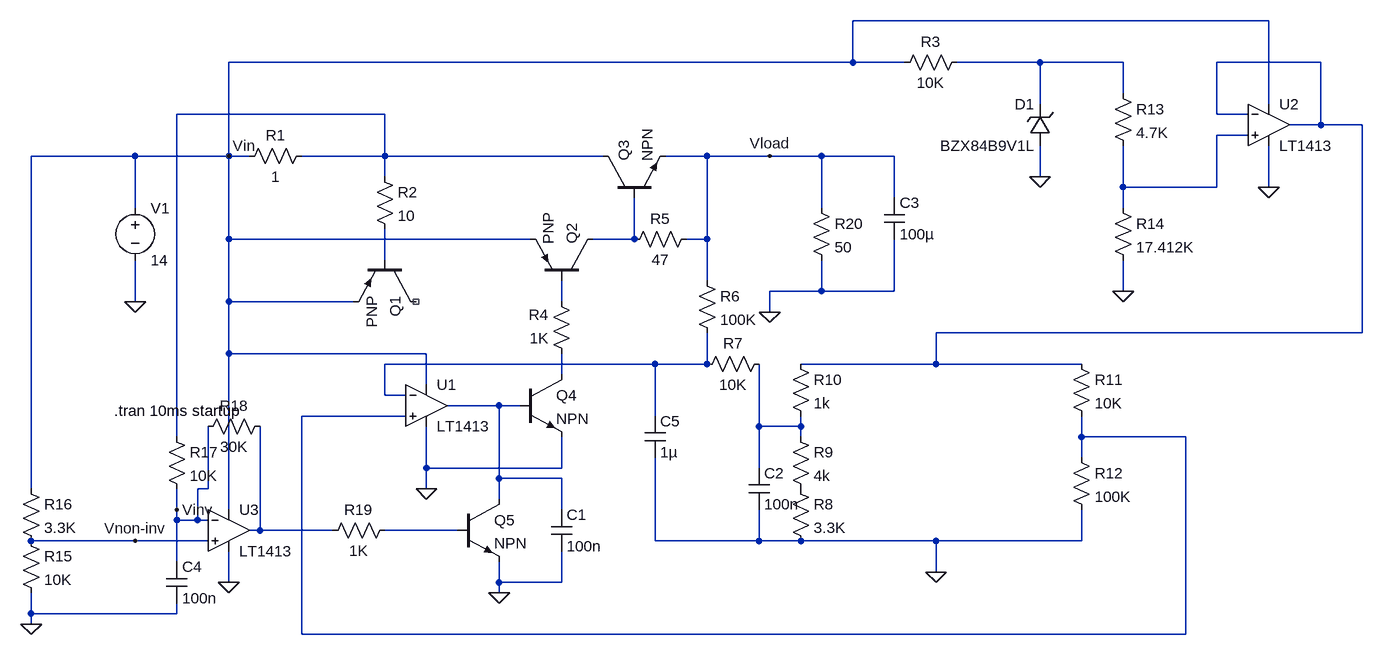
[diagram p0: schematic lm723_voltage_regulator.asc]
lm723_voltage_regulator.asc, the LTspice schematic file:
Version 4
SHEET 1 1988 804
WIRE 1840 -144 1200 -144
WIRE 1200 -80 1200 -144
WIRE 1200 -80 240 -80
WIRE 1280 -80 1200 -80
WIRE 1488 -80 1360 -80
WIRE 1616 -80 1488 -80
WIRE 1920 -80 1760 -80
WIRE 1616 -32 1616 -80
WIRE 1488 -16 1488 -80
WIRE 1840 -16 1840 -144
WIRE 480 0 160 0
WIRE 1760 0 1760 -80
WIRE 1808 0 1760 0
WIRE 1920 16 1920 -80
WIRE 1920 16 1872 16
WIRE 1984 16 1920 16
WIRE 1808 32 1760 32
WIRE 96 64 -64 64
WIRE 240 64 240 -80
WIRE 240 64 96 64
WIRE 272 64 240 64
WIRE 480 64 480 0
WIRE 480 64 352 64
WIRE 816 64 480 64
WIRE 976 64 912 64
WIRE 1072 64 976 64
WIRE 1152 64 1072 64
WIRE 1264 64 1152 64
WIRE 480 96 480 64
WIRE 1488 96 1488 48
WIRE 1616 112 1616 48
WIRE 1760 112 1760 32
WIRE 1760 112 1616 112
WIRE 1840 112 1840 48
WIRE 1264 128 1264 64
WIRE 96 144 96 64
WIRE 1152 144 1152 64
WIRE 1616 144 1616 112
WIRE 240 192 240 64
WIRE 704 192 240 192
WIRE 864 192 864 128
WIRE 864 192 800 192
WIRE 976 192 976 64
WIRE 976 192 944 192
WIRE 480 224 480 176
WIRE 976 256 976 192
WIRE 1152 272 1152 224
WIRE 1152 272 1072 272
WIRE 1264 272 1264 192
WIRE 1264 272 1152 272
WIRE 1616 272 1616 224
WIRE 96 288 96 224
WIRE 240 288 240 192
WIRE 432 288 240 288
WIRE 752 288 752 256
WIRE 1072 304 1072 272
WIRE 1984 336 1984 16
WIRE 1984 336 1328 336
WIRE 240 368 240 288
WIRE 544 368 240 368
WIRE 896 384 480 384
WIRE 976 384 976 336
WIRE 976 384 896 384
WIRE 1328 384 1328 336
WIRE 1328 384 1120 384
WIRE 1552 384 1328 384
WIRE 752 400 752 368
WIRE 544 416 544 368
WIRE 480 432 480 384
WIRE 512 432 480 432
WIRE 656 448 576 448
WIRE 688 448 656 448
WIRE 512 464 352 464
WIRE 896 464 896 384
WIRE 1056 480 1056 384
WIRE 1120 480 1120 464
WIRE 1120 480 1056 480
WIRE 160 496 160 0
WIRE 1120 496 1120 480
WIRE 1552 496 1552 464
WIRE 1712 496 1552 496
WIRE 1552 528 1552 496
WIRE 544 544 544 480
WIRE 752 544 752 496
WIRE 752 544 544 544
WIRE 1056 544 1056 480
WIRE 656 560 656 448
WIRE 752 560 656 560
WIRE -64 576 -64 64
WIRE 208 576 208 480
WIRE 208 576 192 576
WIRE 544 576 544 544
WIRE 656 592 656 560
WIRE 160 608 160 576
WIRE 240 608 240 368
WIRE 752 608 752 560
WIRE 160 624 160 608
WIRE 192 624 192 576
WIRE 192 624 160 624
WIRE 208 624 192 624
WIRE 288 640 288 480
WIRE 288 640 272 640
WIRE 400 640 288 640
WIRE 592 640 480 640
WIRE 96 656 -64 656
WIRE 208 656 96 656
WIRE 896 656 896 528
WIRE 1056 656 1056 608
WIRE 1056 656 896 656
WIRE 1120 656 1056 656
WIRE 1328 656 1120 656
WIRE 1552 656 1552 608
WIRE 1552 656 1328 656
WIRE 160 688 160 624
WIRE 1328 704 1328 656
WIRE 240 720 240 672
WIRE 656 720 656 688
WIRE 752 720 752 672
WIRE 752 720 656 720
WIRE 656 736 656 720
WIRE -64 768 -64 736
WIRE 160 768 160 752
WIRE 160 768 -64 768
WIRE -64 784 -64 768
WIRE 352 800 352 464
WIRE 1712 800 1712 496
WIRE 1712 800 352 800
FLAG 96 288 0
FLAG 1072 304 0
FLAG 240 64 Vin
FLAG 1072 64 Vload
FLAG 544 576 0
FLAG 1328 704 0
FLAG 1488 96 0
FLAG 1616 272 0
FLAG 1840 112 0
FLAG 656 736 0
FLAG 240 720 0
FLAG -64 784 0
FLAG 96 656 Vnon-inv
FLAG 160 608 Vinv
SYMBOL voltage 96 128 R0
WINDOW 123 0 0 Left 0
WINDOW 39 0 0 Left 0
SYMATTR InstName V1
SYMATTR Value 14
SYMBOL res 368 48 R90
WINDOW 0 0 56 VBottom 2
WINDOW 3 32 56 VTop 2
SYMATTR InstName R1
SYMATTR Value 1
SYMBOL pnp 528 224 R90
SYMATTR InstName Q1
SYMBOL res 464 80 R0
SYMATTR InstName R2
SYMATTR Value 10
SYMBOL pnp 800 256 M270
SYMATTR InstName Q2
SYMBOL npn 816 128 R270
SYMATTR InstName Q3
SYMBOL Opamps\\LT1413 544 384 R0
SYMATTR InstName U1
SYMBOL npn 688 400 R0
SYMATTR InstName Q4
SYMBOL res 768 384 R180
WINDOW 0 36 76 Left 2
WINDOW 3 36 40 Left 2
SYMATTR InstName R4
SYMATTR Value 1K
SYMBOL res 960 176 R90
WINDOW 0 0 56 VBottom 2
WINDOW 3 32 56 VTop 2
SYMATTR InstName R5
SYMATTR Value 47
SYMBOL res 960 240 R0
SYMATTR InstName R6
SYMATTR Value 100K
SYMBOL res 1072 368 R90
WINDOW 0 0 56 VBottom 2
WINDOW 3 32 56 VTop 2
SYMATTR InstName R7
SYMATTR Value 10K
SYMBOL res 1104 560 R0
SYMATTR InstName R8
SYMATTR Value 3.3K
SYMBOL res 1104 480 R0
SYMATTR InstName R9
SYMATTR Value 4k
SYMBOL res 1104 368 R0
SYMATTR InstName R10
SYMATTR Value 1k
SYMBOL res 1536 368 R0
SYMATTR InstName R11
SYMATTR Value 10K
SYMBOL res 1536 512 R0
SYMATTR InstName R12
SYMATTR Value 100K
SYMBOL zener 1504 48 R180
WINDOW 0 24 64 Left 2
WINDOW 3 24 0 Left 2
SYMATTR InstName D1
SYMATTR Value BZX84B9V1L
SYMBOL res 1376 -96 R90
WINDOW 0 0 56 VBottom 2
WINDOW 3 32 56 VTop 2
SYMATTR InstName R3
SYMATTR Value 10K
SYMBOL res 1600 -48 R0
SYMATTR InstName R13
SYMATTR Value 4.7K
SYMBOL res 1600 128 R0
SYMATTR InstName R14
SYMATTR Value 17.412K
SYMBOL Opamps\\LT1413 1840 -48 R0
SYMATTR InstName U2
SYMBOL npn 592 592 R0
SYMATTR InstName Q5
SYMBOL Opamps\\LT1413 240 576 R0
SYMATTR InstName U3
SYMBOL res -80 640 R0
SYMATTR InstName R15
SYMATTR Value 10K
SYMBOL res -80 560 R0
SYMATTR InstName R16
SYMATTR Value 3.3K
SYMBOL res 144 480 R0
SYMATTR InstName R17
SYMATTR Value 10K
SYMBOL res 304 464 R90
WINDOW 0 0 56 VBottom 2
WINDOW 3 32 56 VTop 2
SYMATTR InstName R18
SYMATTR Value 30K
SYMBOL res 496 624 R90
WINDOW 0 0 56 VBottom 2
WINDOW 3 32 56 VTop 2
SYMATTR InstName R19
SYMATTR Value 1K
SYMBOL res 1136 128 R0
SYMATTR InstName R20
SYMATTR Value 50
SYMBOL cap 736 608 R0
SYMATTR InstName C1
SYMATTR Value 100n
SYMBOL cap 1040 544 R0
SYMATTR InstName C2
SYMATTR Value 100n
SYMBOL cap 1248 128 R0
SYMATTR InstName C3
SYMATTR Value 100µ
SYMBOL cap 144 688 R0
SYMATTR InstName C4
SYMATTR Value 100n
SYMBOL cap 880 464 R0
SYMATTR InstName C5
SYMATTR Value 1µ
TEXT 64 456 Left 2 !.tran 10ms startup

The netlist it stands for:
* lm723_voltage_regulator.asc
V1 Vin 0 14
R1 N003 Vin 1
Q1 NC_01 N006 Vin 0 PNP
R2 N003 N006 10
Q2 N005 N007 Vin 0 PNP
Q3 N003 N005 Vload 0 NPN
XU1 N011 N008 Vin 0 N010 LT1413  ; pins In+ In- V+ V- OUT
Q4 N009 N010 0 0 NPN
R4 N009 N007 1K
R5 Vload N005 47
R6 Vload N008 100K
R7 N012 N008 10K
R8 P001 0 3.3K
R9 N012 P001 4k
R10 N002 N012 1k
R11 N002 N011 10K
R12 N011 0 100K
D1 0 N001 BZX84B9V1L
R3 N001 Vin 10K
R13 N001 N004 4.7K
R14 N004 0 17.412K
XU2 N004 N002 Vin 0 N002 LT1413  ; pins In+ In- V+ V- OUT
Q5 N010 N014 0 0 NPN
XU3 Vnon-inv Vinv Vin 0 N013 LT1413  ; pins In+ In- V+ V- OUT
R15 Vnon-inv 0 10K
R16 Vin Vnon-inv 3.3K
R17 N003 Vinv 10K
R18 N013 Vinv 30K
R19 N014 N013 1K
R20 Vload 0 50
C1 N010 0 100n
C2 N012 0 100n
C3 Vload 0 100µ
C4 Vinv 0 100n
C5 N008 0 1µ
.model D D
.lib standard.dio
.model NPN NPN
.model PNP PNP
.lib standard.bjt
.tran 10ms startup
.lib LTC.lib
.backanno
.end